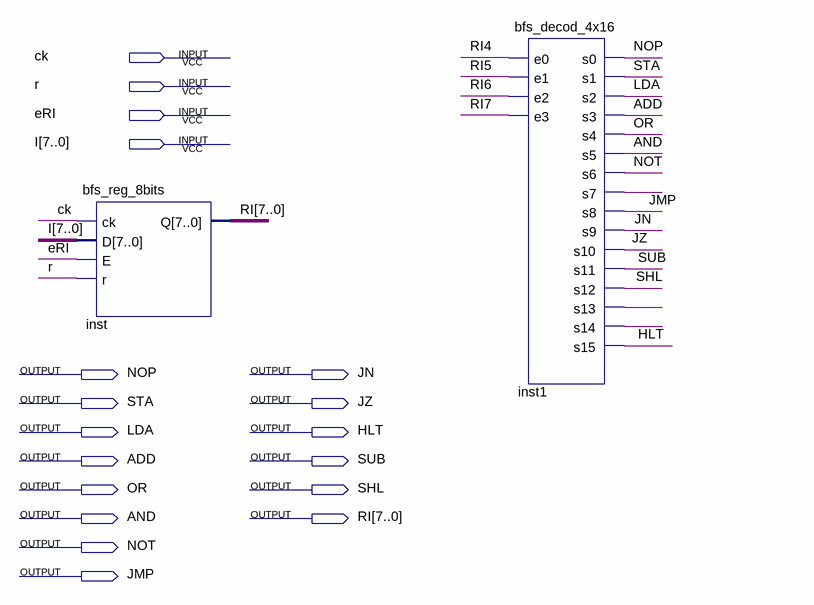
[diagram p0: schematic sheet]
// Quartus schematic bfs_OPdecod.bdf as structural Verilog: 2 symbols, 18 pins
module bfs_OPdecod (
  input  ck,
  input  r,
  input  eRI,
  input  [7:0] I,
  output NOP,
  output JN,
  output STA,
  output JZ,
  output LDA,
  output HLT,
  output ADD,
  output SUB,
  output OR,
  output SHL,
  output AND,
  output [7:0] RI,
  output NOT,
  output JMP
);

  wire inst1_s7, inst1_s13, inst1_s14;

  bfs_reg_8bits inst (.ck(ck), .D(I), .E(eRI), .r(r), .Q(RI));
  bfs_decod_4x16 inst1 (
    .e0(RI[4]), .e1(RI[5]), .e2(RI[6]), .e3(RI[7]), .s0(NOP), .s1(STA), .s2(LDA), .s3(ADD), .s4(OR),
    .s5(AND), .s6(NOT), .s7(inst1_s7), .s8(JMP), .s9(JN), .s10(JZ), .s11(SUB), .s12(SHL), .s13(inst1_s13),
    .s14(inst1_s14), .s15(HLT));
endmodule
